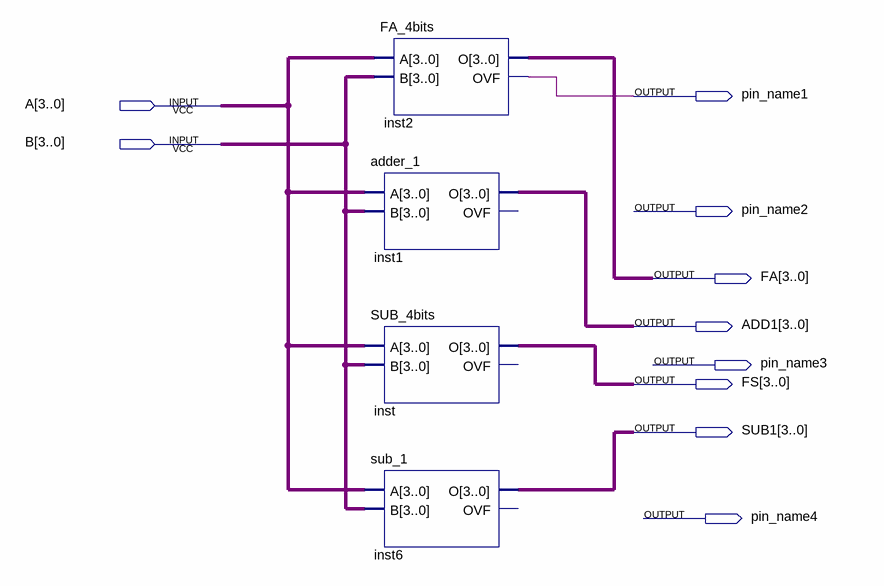
[diagram p0: schematic sheet]
// Quartus schematic Lab3.bdf as structural Verilog: 4 symbols, 10 pins
module Lab3 (
  input  [3:0] A,
  input  [3:0] B,
  output pin_name1,
  output pin_name2,
  output [3:0] FA,
  output [3:0] ADD1,
  output pin_name3,
  output [3:0] FS,
  output [3:0] SUB1,
  output pin_name4
);

  FA_4bits inst2 (.A(A), .B(B), .O(FA), .OVF(pin_name1));
  adder_1 inst1 (.A(A), .B(B), .O(ADD1));  // open: OVF
  SUB_4bits inst (.A(A), .B(B), .O(FS));  // open: OVF
  sub_1 inst6 (.A(A), .B(B), .O(SUB1));  // open: OVF
endmodule
